# Altium schematic sheet pca10184_debugger_mcu.SchDoc: =ProductName + ' - Debugger'
size A3; DocumentNumber: 3; SheetNumber: 3; SheetTotal: 9
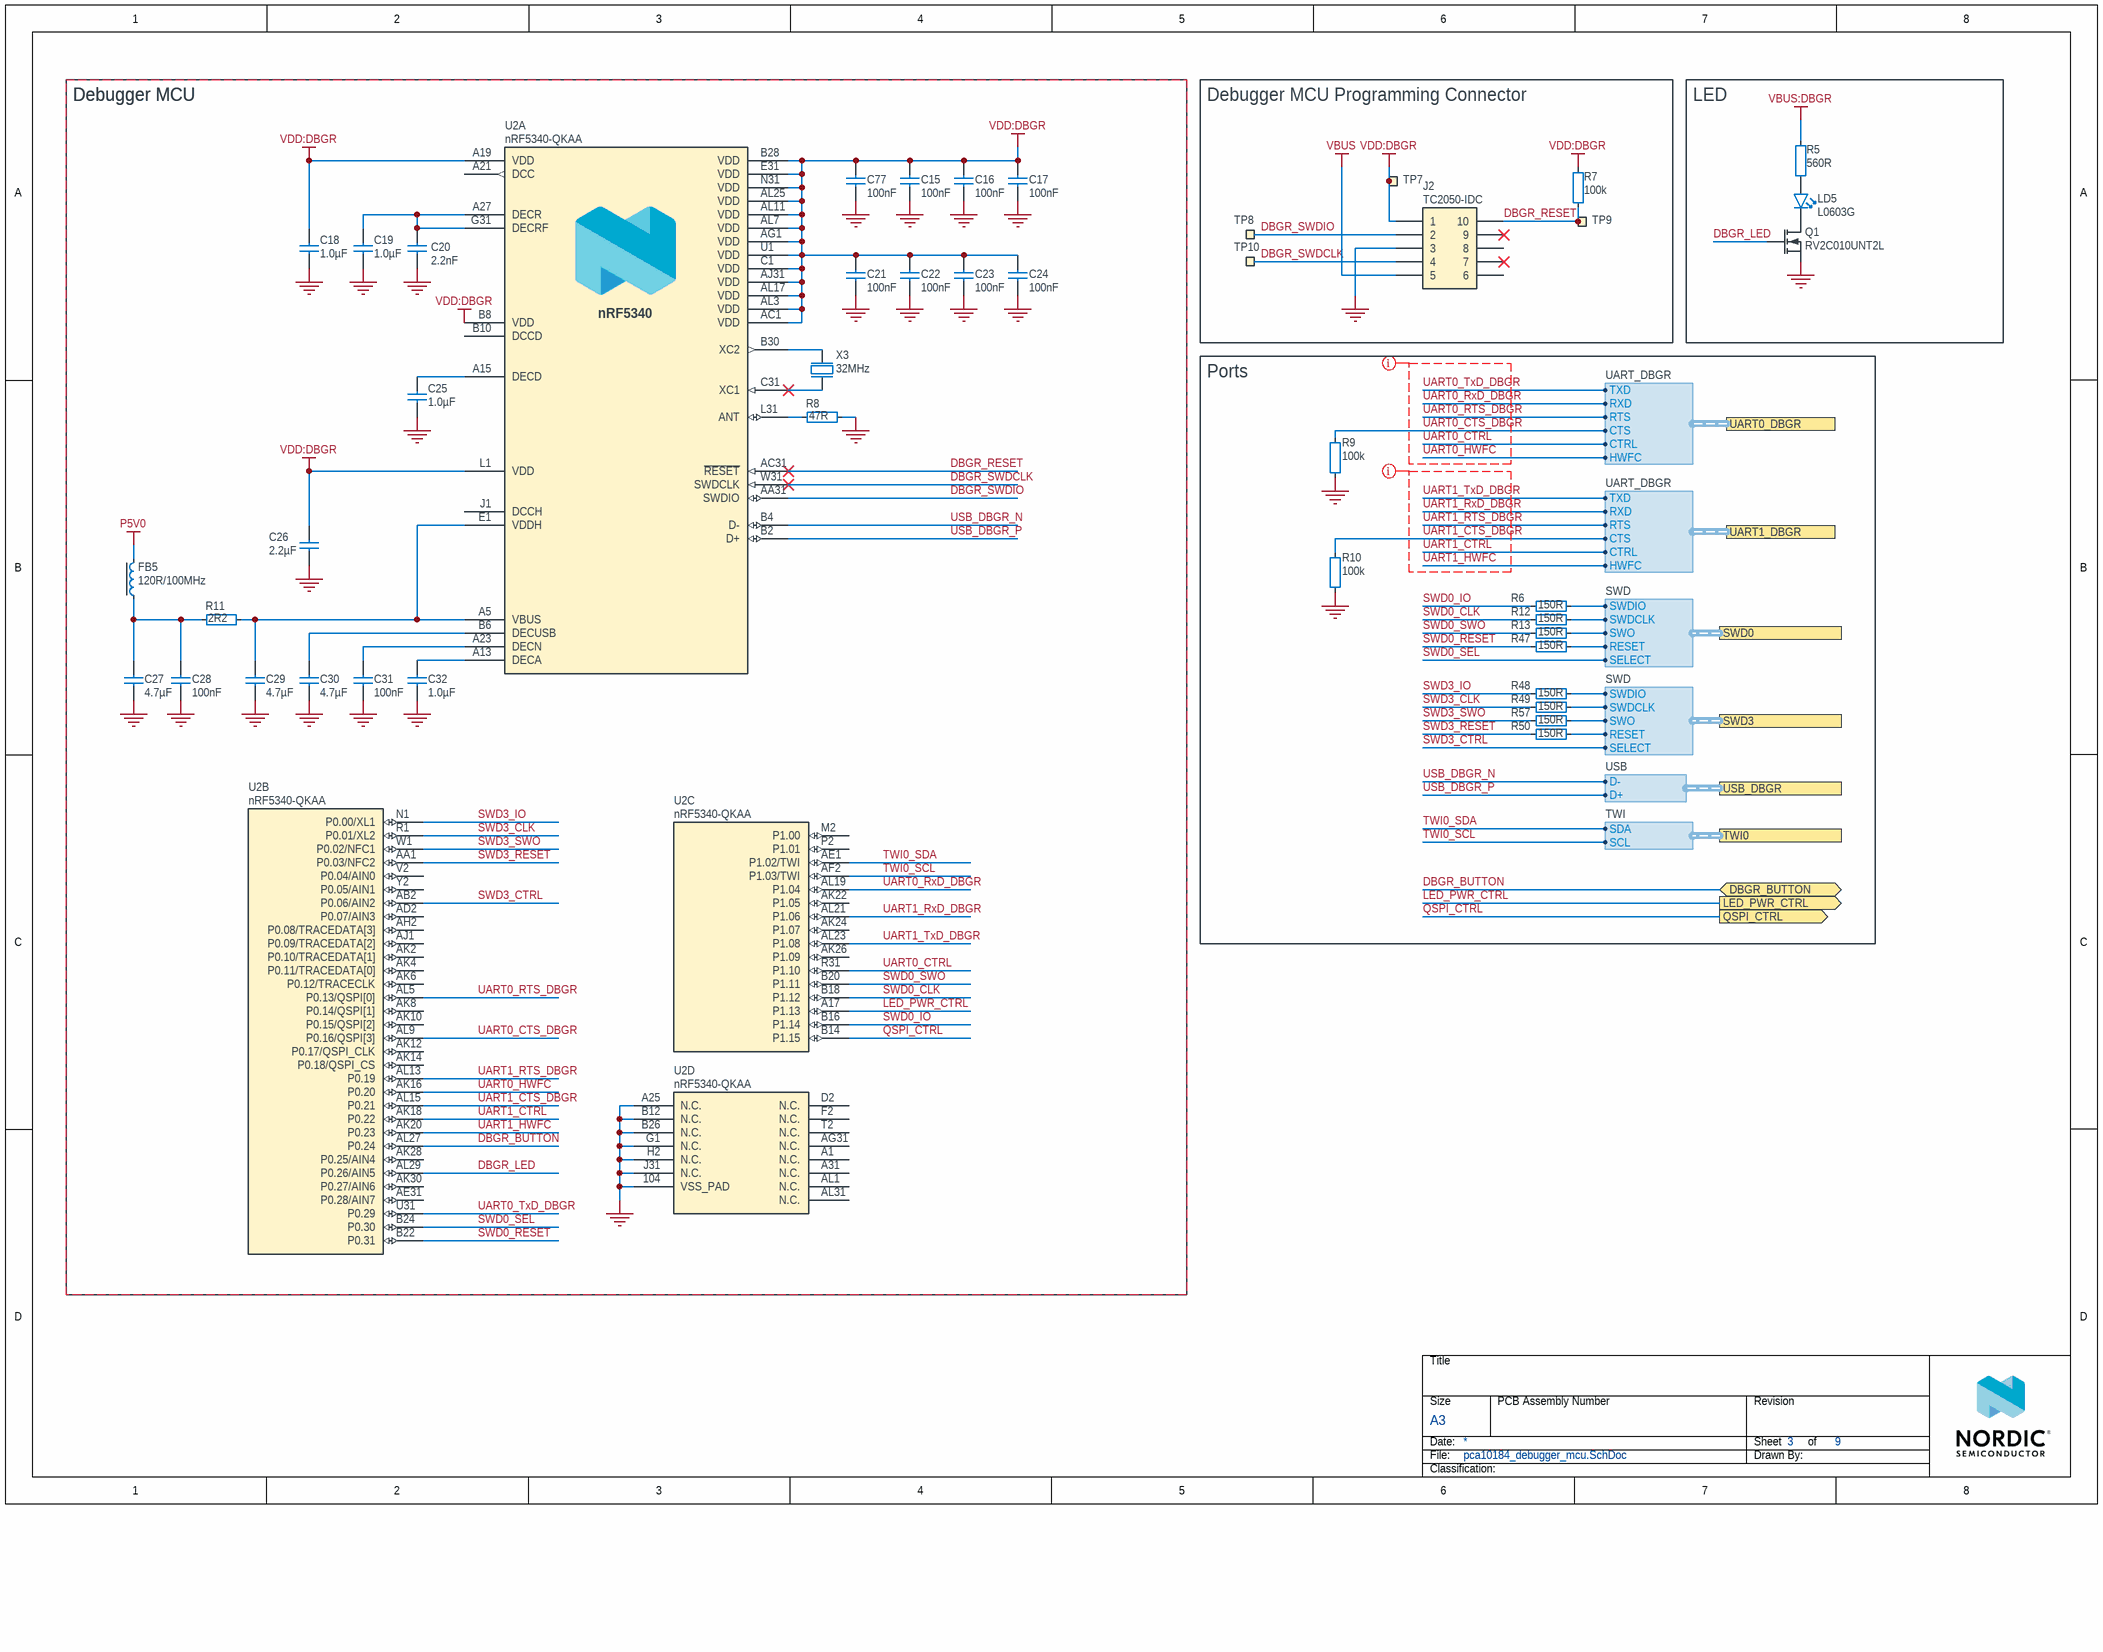
[diagram p0: pca10184_debugger_mcu.SchDoc]

## Parts
C15  100nF  [CAPC0603X03L_C]
C16  100nF  [CAPC0603X03L_C]
C17  100nF  [CAPC0603X03L_C]
C18  1.0µF  [CAPC1005X04L]
C19  1.0µF  [CAPC1005X04L]
C20  2.2nF  [CAPC0603X03L_C]
C21  100nF  [CAPC0603X03L_C]
C22  100nF  [CAPC0603X03L_C]
C23  100nF  [CAPC0603X03L_C]
C24  100nF  [CAPC0603X03L_C]
C25  1.0µF  [CAPC1005X04L]
C26  2.2µF  [CAPC1608X06L]
C27  4.7µF  [CAPC1608X06L]
C28  100nF  [CAPC0603X03L_C]
C29  4.7µF  [CAPC1608X06L]
C30  4.7µF  [CAPC1608X06L]
C31  100nF  [CAPC0603X03L_C]
C32  1.0µF  [CAPC1005X04L]
C77  100nF  [CAPC0603X03L_C]
FB5  120R/100MHz  [INDC1005X04L_C2]
J2  TC2050-IDC  [TC2050-IDC-NLFP]  (no BOM)
LD5  L0603G  [LED_0603_G]
Q1  RV2C010UNT2L  [DFN65P100X40-3L]
R5  560R  [RESC0603X03L_C]
R6  150R  [RESC0603X03L_C]
R7  100k  [RESC0603X03L_C]
R8  47R  [RESC0603X03L_C]
R9  100k  [RESC0603X03L_C]
R10  100k  [RESC0603X03L_C]
R11  2R2  [RESC1608X06L]
R12  150R  [RESC0603X03L_C]
R13  150R  [RESC0603X03L_C]
R47  150R  [RESC0603X03L_C]
R48  150R  [RESC0603X03L_C]
R49  150R  [RESC0603X03L_C]
R50  150R  [RESC0603X03L_C]
R57  150R  [RESC0603X03L_C]
TP7  Ø1.5mm,SMD  [TP_SMD_D1.5mm]  (value not drawn)  (no BOM)
TP8  Ø1.5mm,SMD  [TP_SMD_D1.5mm]  (value not drawn)  (no BOM)
TP9  Ø1.5mm,SMD  [TP_SMD_D1.5mm]  (value not drawn)  (no BOM)
TP10  Ø1.5mm,SMD  [TP_SMD_D1.5mm]  (value not drawn)  (no BOM)
U2  nRF5340-QKAA  [AQFN40P700X700X85_HS-99N]  (parts A,B,C,D of 4)
X3  32MHz  [BT-XTAL_2016]

## Blocks framed on the sheet
Debugger MCU Programming Connector: J2 R7 TP7-TP10
LED: LD5 Q1 R5
Ports: R6 R9 R10 R12 R13 R47-R50 R57

## Ports
DBGR_BUTTON (bidir), LED_PWR_CTRL (out), QSPI_CTRL (out), SWD0 (harness SWD), SWD3 (harness SWD), TWI0 (harness TWI), UART0_DBGR (harness UART_DBGR), UART1_DBGR (harness UART_DBGR), USB_DBGR (harness USB)

## Harnesses
UART_DBGR: RTS, CTS, RXD, TXD, HWFC, CTRL
SWD: SWDIO, SWDCLK, SWO, RESET, SELECT
USB: D+, D-
TWI: SCL, SDA

## Nets
GND: C15.2 C16.2 C17.2 C18.2 C19.1 C20.2 C21.2 C22.2 C23.2 C24.2 C25.1 C26.2 C27.2 C28.2 C29.2 C30.2 C31.2 C32.1 C77.2 J2.3 Q1.2(S) R8.2 R9.2 R10.2 U2.104(VSS_PAD) U2.A25(N.C.) U2.B12(N.C.) U2.B26(N.C.) U2.G1(N.C.) U2.H2(N.C.) U2.J31(N.C.) X3.2(GND) X3.4(GND)
P5V0: FB5.2
VBUS: J2.5
VBUS:DBGR: R5.2
VDD:DBGR: C15.1 C16.1 C17.1 C18.1 C21.1 C22.1 C23.1 C24.1 C26.1 C77.1 J2.1 R7.2 TP7.1 U2.A19(VDD) U2.AC1(VDD) U2.AG1(VDD) U2.AJ31(VDD) U2.AL3(VDD) U2.AL7(VDD) U2.AL11(VDD) U2.AL17(VDD) U2.AL25(VDD) U2.B8(VDD) U2.B28(VDD) U2.C1(VDD) U2.E31(VDD) U2.L1(VDD) U2.N31(VDD) U2.U1(VDD)
DBGR_BUTTON: U2.AL27(P0.24) ; port DBGR_BUTTON
DBGR_LED: Q1.1(G) U2.AL29(P0.26/AIN5)
DBGR_RESET: J2.10 R7.1 TP9.1 U2.AC31(~{RESET})
DBGR_SWDCLK: J2.4 TP10.1 U2.W31(SWDCLK)
DBGR_SWDIO: J2.2 TP8.1 U2.AA31(SWDIO)
LED_PWR_CTRL: U2.A17(P1.13) ; port LED_PWR_CTRL
QSPI_CTRL: U2.B14(P1.15) ; port QSPI_CTRL
SWD0_CLK: R12.1 U2.B18(P1.12)
SWD0_IO: R6.1 U2.B16(P1.14)
SWD0_RESET: R47.1 U2.B22(P0.31)
SWD0_SEL: U2.B24(P0.30) ; port SWD0.SELECT
SWD0_SWO: R13.1 U2.B20(P1.11)
SWD3_CLK: R49.1 U2.R1(P0.01/XL2)
SWD3_CTRL: U2.AB2(P0.06/AIN2) ; port SWD3.SELECT
SWD3_IO: R48.1 U2.N1(P0.00/XL1)
SWD3_RESET: R50.1 U2.AA1(P0.03/NFC2)
SWD3_SWO: R57.1 U2.W1(P0.02/NFC1)
TWI0_SCL: U2.AF2(P1.03/TWI) ; port TWI0.SCL
TWI0_SDA: U2.AE1(P1.02/TWI) ; port TWI0.SDA
UART0_CTRL: U2.R31(P1.10) ; port UART0_DBGR.CTRL
UART0_CTS_DBGR: R9.1 U2.AL9(P0.16/QSPI[3]) ; port UART0_DBGR.CTS
UART0_HWFC: U2.AK16(P0.20) ; port UART0_DBGR.HWFC
UART0_RTS_DBGR: U2.AL5(P0.13/QSPI[0]) ; port UART0_DBGR.RTS
UART0_RxD_DBGR: U2.AL19(P1.04) ; port UART0_DBGR.RXD
UART0_TxD_DBGR: U2.U31(P0.29) ; port UART0_DBGR.TXD
UART1_CTRL: U2.AK18(P0.22) ; port UART1_DBGR.CTRL
UART1_CTS_DBGR: R10.1 U2.AL15(P0.21) ; port UART1_DBGR.CTS
UART1_HWFC: U2.AK20(P0.23) ; port UART1_DBGR.HWFC
UART1_RTS_DBGR: U2.AL13(P0.19) ; port UART1_DBGR.RTS
UART1_RxD_DBGR: U2.AL21(P1.06) ; port UART1_DBGR.RXD
UART1_TxD_DBGR: U2.AL23(P1.08) ; port UART1_DBGR.TXD
USB_DBGR_N: U2.B4(D-) ; port USB_DBGR.D-
USB_DBGR_P: U2.B2(D+) ; port USB_DBGR.D+
NetC19_2: C19.2 C20.1 U2.A27(DECR) U2.G31(DECRF)
NetC25_2: C25.2 U2.A15(DECD)
NetC27_1: C27.1 C28.1 FB5.1 R11.1
NetC29_1: C29.1 R11.2 U2.A5(VBUS) U2.E1(VDDH)
NetC30_1: C30.1 U2.B6(DECUSB)
NetC31_1: C31.1 U2.A23(DECN)
NetC32_2: C32.2 U2.A13(DECA)
NetLD5_1: LD5.1(C) Q1.3(D)
NetLD5_2: LD5.2(A) R5.1
NetR6_2: R6.2 ; port SWD0.SWDIO
NetR8_1: R8.1 U2.L31(ANT)
NetR12_2: R12.2 ; port SWD0.SWDCLK
NetR13_2: R13.2 ; port SWD0.SWO
NetR47_2: R47.2 ; port SWD0.RESET
NetR48_2: R48.2 ; port SWD3.SWDIO
NetR49_2: R49.2 ; port SWD3.SWDCLK
NetR50_2: R50.2 ; port SWD3.RESET
NetR57_2: R57.2 ; port SWD3.SWO
NetU2_B30: U2.B30(XC2) X3.3(out)
NetU2_C31: U2.C31(XC1) X3.1(inp)

Not connected (* = marked no-connect by the designer): J2 6 7* 8 9*; U2 A1(N.C.) A21(DCC) A31(N.C.) AD2(P0.07/AIN3) AE31(P0.28/AIN7) AG31(N.C.) AH2(P0.08/TRACEDATA[3]) AJ1(P0.09/TRACEDATA[2]) AK2(P0.10/TRACEDATA[1]) AK4(P0.11/TRACEDATA[0]) AK6(P0.12/TRACECLK) AK8(P0.14/QSPI[1]) AK10(P0.15/QSPI[2]) AK12(P0.17/QSPI_CLK) AK14(P0.18/QSPI_CS) AK22(P1.05) AK24(P1.07) AK26(P1.09) AK28(P0.25/AIN4) AK30(P0.27/AIN6) AL1(N.C.) AL31(N.C.) B10(DCCD) D2(N.C.) F2(N.C.) J1(DCCH) M2(P1.00) P2(P1.01) T2(N.C.) V2(P0.04/AIN0) Y2(P0.05/AIN1)

## Layout directives
net class UART0: UART0_CTRL, UART0_CTS_DBGR, UART0_HWFC, UART0_RTS_DBGR, UART0_RxD_DBGR, UART0_TxD_DBGR
net class UART1: UART1_CTRL, UART1_CTS_DBGR, UART1_HWFC, UART1_RTS_DBGR, UART1_RxD_DBGR, UART1_TxD_DBGR

## Notes on the sheet
- Debugger MCU
- Title
- Size
- Date:
- File:
- A3
- PCB Assembly Number
- Sheet
- Drawn By:
- Revision
- of
- Classification:
- (in symbol nRF5340-QKAAD0, part A) nRF5340

## Library data of the parts
C15-C17 C21-C24 C28 C31 C77 = C0201-100n: Capacitor, X5R, ±10%, 100nF, 16V; Manufacturer: N.A.; Part number IPS: 00000001248, 00000002505; Part number Norautron: 262071862; Part number NEMS: 100200078; Pad Count: 2; Component Status: Active; Part Number: C0201-100n; Value: 100nF; Footprint Doc: 0201; Component Class: Capacitors; Author: rsk; PartId: 100200078; Manufacturer Part Number: N.A.; ComponentLink1URL: N.A.; ComponentLink1Description: Datasheet; ComponentLink2URL: N.A.; ComponentLink2Description: Supplier link; HelpURL: N.A.; LatestRevisionDate: 2024-06-27; Published: 2014-11-13; Note: 16V; Supplier 1: N.A.; Supplier Part Number 1: N.A.; Supplier 2: N.A.; Supplier Part Number 2: N.A.; Artikkelnr Noca: N.A.
C18 C19 C25 C32 = C0402-1µ0-6.3V-X5R-10%: Capacitor, X5R, ±10%, 6.3V; Manufacturer: N.A.; Part number Norautron: 26207137; Part number NEMS: 100200498; Pad Count: 2; Component Status: Active; Part Number: C0402-1µ0-6.3V-X5R-10%; Manufacturer Part Number: N.A.; LatestRevisionDate: 2022-01-27; Published: 2022-01-27; Value: 1.0µF; Note: 6.3V; Artikkelnr Noca: N.A.; Footprint Doc: 0402; ComponentLink1URL: N.A.; ComponentLink1Description: Datasheet; ComponentLink2URL: N.A.; ComponentLink2Description: Supplier link; HelpURL: N.A.; Supplier 1: N.A.; Supplier Part Number 1: N.A.; Supplier 2: N.A.; Supplier Part Number 2: N.A.; Part number IPS: N.A.; Component Class: Capacitors; PartId: 100200498; Author: rubr
C20 = C0201-2n2: Capacitor, X7R, ±10%, 10V; Manufacturer: N.A.; Part number IPS: 00000001778; Part number Norautron: 26470002; Part number NEMS: 100200060; Pad Count: 2; Component Status: Active; Part Number: C0201-2n2; LatestRevisionDate: 2014-11-13; Published: 2014-11-13; Value: 2.2nF; Footprint Doc: 0201; Manufacturer Part Number: N.A.; ComponentLink1URL: N.A.; ComponentLink1Description: Datasheet; ComponentLink2URL: N.A.; ComponentLink2Description: Supplier link; HelpURL: N.A.; Note: 10V; Supplier 1: N.A.; Supplier Part Number 1: N.A.; Supplier 2: N.A.; Supplier Part Number 2: N.A.; Artikkelnr Noca: N.A.; Component Class: Capacitors; PartId: 100200060; Author: rsk
C26 = C0603-2µ2-6.3V-X7R: Capacitor, X7R, ±10%, 2.2µF, 6.3V; Manufacturer: N.A.; Part number NEMS: 100200272; Artikkelnr Noca: 20039322; Pad Count: 2; Component Status: Active; Part Number: C0603-2µ2-6.3V-X7R; Manufacturer Part Number: N.A.; LatestRevisionDate: 2024-06-27; Published: 2009-05-08; Value: 2.2µF; Note: 6.3V; Footprint Doc: 0603; ComponentLink1URL: N.A.; ComponentLink1Description: Datasheet; ComponentLink2URL: N.A.; ComponentLink2Description: Supplier link; HelpURL: N.A.; Supplier 1: N.A.; Supplier Part Number 1: N.A.; Supplier 2: N.A.; Supplier Part Number 2: N.A.; Part number IPS: N.A.; Component Class: Capacitors; PartId: 100200272; Author: rsk; Part number Norautron: N.A.
C27 C29 = C0603-4µ7-10V-X7S: Capacitor, X7S, ±10%, 10V; Manufacturer: N.A.; Part number IPS: 00000001779; Part number NEMS: 100200351; Pad Count: 2; Artikkelnr Noca: 20030013; Component Status: Active; Part Number: C0603-4µ7-10V-X7S; Value: 4.7µF; Footprint Doc: 0603; Component Class: Capacitors; Author: rsk; PartId: 100200351; Manufacturer Part Number: N.A.; ComponentLink1URL: N.A.; ComponentLink1Description: Datasheet; ComponentLink2URL: N.A.; ComponentLink2Description: Supplier link; HelpURL: N.A.; LatestRevisionDate: 2016-08-15; Published: 2016-08-15; Note: 10V; Supplier 1: Digi-Key; Supplier Part Number 1: 445-14258-1-ND; Supplier 2: N.A.; Supplier Part Number 2: N.A.; Part number Norautron: N.A.
C30 = C0603-4µ7-6.3V-X7R: Capacitor, X7R, ±10%, 6.3V; Manufacturer: Samsung Electro-Mechanics America; Manufacturer Part Number: CL10B475KQ8NQNC; Part number IPS: 00000002541; Part number Norautron: N.A.; Part number NEMS: 100200350; Pad Count: 2; Artikkelnr Noca: 20039473; Component Status: Active; Part Number: C0603-4µ7-6.3V-X7R; Value: 4.7µF; Footprint Doc: 0603; Component Class: Capacitors; Author: rsk; PartId: 100200350; ComponentLink1URL: N.A.; ComponentLink1Description: Datasheet; ComponentLink2URL: N.A.; ComponentLink2Description: Supplier link; HelpURL: http://media.digikey.com/pdf/Data%20Sheets/Samsung%20PDFs/CL10B475KQ8NQNC_Spec.pdf; LatestRevisionDate: 2015-06-10; Published: 2015-06-10; Note: 6.3V; Supplier 1: Digi-Key; Supplier Part Number 1: 1276-2087-1-ND; Supplier 2: N.A.; Supplier Part Number 2: N.A.
FB5 = FB0402-120R@100MHz-1200mA-BLM15EX121SN1_C2: Ferrite Bead, 120 Ohm @ 100MHz, 1200mA, 75 mOhm Max; Manufacturer: Murata; Part number NEMS: 100300431, 100300416; Component Status: Active; Pad Count: 2; Note: N.A.; Part Number: FB0402-120R@100MHz-1200mA-BLM15EX121SN1_C2; PartId: 100300431; Component Class: Inductors; Author: rubr; Manufacturer Part Number: BLM15EX121SN1; ComponentLink1URL: https://www.murata.com/en-us/products/productdata/8796750970910/ENFA0023.pdf; ComponentLink1Description: Datasheet; ComponentLink2URL: N.A.; ComponentLink2Description: Supplier link; HelpURL: https://www.murata.com/en-us/products/productdetail?partno=BLM15EX121SN1%23; LatestRevisionDate: 2023-03-22; Published: 2023-03-22; Footprint Doc: 0402; Value: 120R/100MHz; Supplier 1: Digi-Key; Supplier Part Number 1: 490-16509-1-ND; Supplier 2: Mouser; Supplier Part Number 2: 81-BLM15EX121SN1D; Artikkelnr Noca: N.A.; Part number IPS: N.A.; Part number Norautron: N.A.
J2 = TC2050-IDC-NLFP: CBL PLUG-OF-NAILS 10-PIN; Manufacturer: Tag-Connect LLC; Part number NEMS: 100500463; Artikkelnr Noca: N.A.; Pad Count: 10; Component Status: Active; System: Connector; Part Number: TC2050-IDC-NLFP; Manufacturer Part Number: TC2050-IDC-NLFP; LatestRevisionDate: 2012-11-21; Published: 2012-11-21; Value: TC2050-IDC; Footprint Doc: TC2050-IDC-NLFP; Part number IPS: N.A.; ComponentLink1URL: N.A.; ComponentLink1Description: Datasheet; ComponentLink2URL: N.A.; ComponentLink2Description: Supplier link; HelpURL: http://www.tag-connect.com/Materials/TC2050-IDC%20Datasheet.pdf; Supplier 1: Digi-Key; Supplier Part Number 1: TC2050-IDC-NL-ND; Supplier 2: N.A.; Supplier Part Number 2: N.A.; Component Class: Connectors; Note: N.A.; PartId: 100500463; Author: rsk; Part number Norautron: N.A.
LD5 = VS 25C7M5: LED, Green, 0603, 573nm, Vf=2.0V, 24mcd, - 40 to +85°C; Manufacturer: Victory Electronics; Part number IPS: 00000001274, 00000009961; Part number Norautron: 26313411; Part number NEMS: 101400097; Pad Count: 2; Note: N.A.; Artikkelnr Noca: 13019193; Component Status: Active; Part Number: VS 25C7M5; PartId: 101400097; Component Class: Optoelectronics; Author: rsk; Manufacturer Part Number: VS 25C7M5; ComponentLink1URL: N.A.; ComponentLink1Description: Datasheet; ComponentLink2URL: N.A.; ComponentLink2Description: Supplier link; HelpURL: \\hizz\pro\app9717\Datasheet\optoelectronics\Victory Electronics\VS 25C7M5.pdf; Footprint Doc: 0603; LatestRevisionDate: 2020-10-23; Published: 2017-08-21; Value: L0603G; Supplier 1: EC Partner; Supplier Part Number 1: N.A.; Supplier 2: N.A.; Supplier Part Number 2: N.A.
Q1 = RV2C010UNT2L: N-Channel MOSFET, 20V, 1A, 470mOhm, 400mW, -55°C ~ 150°C; Manufacturer: Rohm Semiconductor; Part number IPS: 00000009976; Part number Norautron: 26320026; Part number NEMS: 101300132; Note: N.A.; Artikkelnr Noca: 35010020; Pad Count: 3; Component Status: Active; Part Number: RV2C010UNT2L; Manufacturer Part Number: RV2C010UNT2L; ComponentLink1URL: N.A.; ComponentLink1Description: Datasheet; ComponentLink2URL: N.A.; ComponentLink2Description: Supplier link; HelpURL: http://rohmfs.rohm.com/en/products/databook/datasheet/discrete/transistor/mosfet/rv2c010unt2l-e.pdf; Footprint Doc: DFN-3; LatestRevisionDate: 2024-09-18; Published: 2016-08-09; Value: RV2C010UNT2L; Supplier 1: Digi-Key; Supplier Part Number 1: RV2C010UNT2LCT-ND; Supplier 2: Mouser; Supplier Part Number 2: 755-RV2C010UNT2L; PartId: 101300132; Component Class: Semiconductors; Author: rsk
R5 = R0201-560: Resistor, ±1%, 0.05W; Manufacturer: N.A.; Part number NEMS: 100100038; Note: Chip Res 1%; Pad Count: 2; Component Status: Active; Part Number: R0201-560; Manufacturer Part Number: N.A.; ComponentLink1URL: N.A.; ComponentLink1Description: Datasheet; ComponentLink2URL: N.A.; ComponentLink2Description: Supplier link; HelpURL: N.A.; Footprint Doc: 0201; LatestRevisionDate: 2014-11-13; Published: 2014-11-13; Value: 560R; Supplier 1: N.A.; Supplier Part Number 1: N.A.; Supplier 2: N.A.; Supplier Part Number 2: N.A.; Artikkelnr Noca: N.A.; Part number IPS: N.A.; PartId: 100100038; Component Class: Resistors; Author: rsk; Part number Norautron: N.A.
R6 R12 R13 R47-R50 R57 = R0201-150: Resistor, ±1%, 0.05W; Manufacturer: N.A.; Part number IPS: 00000001420; Part number NEMS: 100100029; Note: Chip Res 1%; Pad Count: 2; Component Status: Active; Part Number: R0201-150; Manufacturer Part Number: N.A.; ComponentLink1URL: N.A.; ComponentLink1Description: Datasheet; ComponentLink2URL: N.A.; ComponentLink2Description: Supplier link; HelpURL: N.A.; Footprint Doc: 0201; LatestRevisionDate: 2014-11-13; Published: 2014-11-13; Value: 150R; Artikkelnr Noca: N.A.; Supplier 1: N.A.; Supplier Part Number 1: N.A.; Supplier 2: N.A.; Supplier Part Number 2: N.A.; PartId: 100100029; Component Class: Resistors; Author: rsk; Part number Norautron: N.A.
R7 R9 R10 = R0201-100k: Resistor, ±1%, 0.05W; Manufacturer: N.A.; Part number IPS: 00000001419; Part number Norautron: 26108487; Part number NEMS: 100100080; Note: Chip Res 1%; Pad Count: 2; Component Status: Active; Part Number: R0201-100k; Manufacturer Part Number: N.A.; ComponentLink1URL: N.A.; ComponentLink1Description: Datasheet; ComponentLink2URL: N.A.; ComponentLink2Description: Supplier link; HelpURL: N.A.; Footprint Doc: 0201; LatestRevisionDate: 2014-11-13; Published: 2014-11-13; Value: 100k; Artikkelnr Noca: N.A.; Supplier 1: N.A.; Supplier Part Number 1: N.A.; Supplier 2: N.A.; Supplier Part Number 2: N.A.; Component Class: Resistors; PartId: 100100080; Author: rsk
R8 = R0201-47R: Resistor, ±1%, 0.05W; Manufacturer: N.A.; Part number IPS: 00000004794; Part number Norautron: 26108300; Part number NEMS: 100100022; Component Status: Active; Pad Count: 2; Note: Chip Res 1%; Part Number: R0201-47R; PartId: 100100022; Component Class: Resistors; Author: rsk; Manufacturer Part Number: N.A.; ComponentLink1URL: N.A.; ComponentLink1Description: Datasheet; ComponentLink2URL: N.A.; ComponentLink2Description: Supplier link; HelpURL: N.A.; LatestRevisionDate: 2014-11-13; Published: 2014-11-13; Footprint Doc: 0201; Value: 47R; Supplier 1: N.A.; Supplier Part Number 1: N.A.; Supplier 2: N.A.; Supplier Part Number 2: N.A.; Artikkelnr Noca: N.A.
R11 = R0603-2R2: RES 2.2 OHM 1% 1/10W 0603; Manufacturer: N.A.; Part number NEMS: 100100736; Pad Count: 2; Note: Chip Res 1%; Component Status: Active; Part Number: R0603-2R2; Footprint Doc: 0603; Value: 2R2; Component Class: Resistors; Author: getr; PartId: 100100736; Manufacturer Part Number: N.A.; ComponentLink1URL: N.A.; ComponentLink1Description: Datasheet; ComponentLink2URL: N.A.; ComponentLink2Description: Supplier link; HelpURL: N.A.; LatestRevisionDate: 2025-05-14; Published: 2025-05-14; Supplier 1: N.A.; Supplier Part Number 1: N.A.; Supplier 2: N.A.; Supplier Part Number 2: N.A.; Artikkelnr Noca: N.A.; Part number IPS: N.A.; Part number Norautron: N.A.
TP7-TP10 = TP_SMD_Ø1.5MM: 1.5mm circular SMD testpad; Manufacturer: Nordic Semiconductor; Manufacturer Part Number: N.A.; Part number NEMS: 100500477; Pad Count: 1; Component Status: Active; Part Number: TP_SMD_Ø1.5MM; ComponentLink1URL: N.A.; ComponentLink1Description: Datasheet; ComponentLink2URL: N.A.; ComponentLink2Description: Supplier link; HelpURL: N.A.; Footprint Doc: TP_SMD_Ø1.5mm; LatestRevisionDate: 2021-03-05; Published: 2016-06-02; Value: Ø1.5mm,SMD; Note: N.A.; Artikkelnr Noca: N.A.; Part number IPS: N.A.; Supplier 1: N.A.; Supplier Part Number 1: N.A.; Supplier 2: N.A.; Supplier Part Number 2: N.A.; Component Class: Connectors; PartId: 100500477; Author: rsk; Part number Norautron: N.A.
U2 = nRF5340-QKAAD0: Multi-protocol Bluetooth Low Energy, IEEE 802.15.4, ANT and 2.4GHz proprietary system-on-chip; Manufacturer: Nordic Semiconductor; Part number Norautron: NOD26470035; Part number NEMS: 102000216; Pad Count: 98; Note: N.A.; Component Status: Active; Part Number: nRF5340-QKAAD0; Footprint Doc: AQFN-98; Value: nRF5340-QKAA; Component Class: Nordic_Devices; Author: rsk; PartId: 102000216; Manufacturer Part Number: nRF5340-QKAAD0; ComponentLink1URL: N.A.; ComponentLink1Description: Datasheet; ComponentLink2URL: N.A.; ComponentLink2Description: Supplier link; HelpURL: N.A.; LatestRevisionDate: 2020-12-02; Published: 2020-12-02; Supplier 1: Nordic Semiconductor; Supplier Part Number 1: nRF5340-QKAAD0; Supplier 2: N.A.; Supplier Part Number 2: N.A.; Artikkelnr Noca: N.A.; Part number IPS: N.A.
X3 = XTAL_SMD2016_32MHz_8pF_Golledge: XTAL SMD 2016, 32MHz, Cl=8pF, Tol: ±10ppm, Stab: ±15ppm; Manufacturer Part Number: MP06003; Part number IPS: 00000001431; Part number Norautron: N.A.; Part number NEMS: 101600041; Note: XTAL SMD 32.000MHz; Artikkelnr Noca: 22010050; Pad Count: 4; Component Status: Active; Part Number: XTAL_SMD2016_32MHz_8pF_Golledge; Manufacturer: Golledge; LatestRevisionDate: 2016-11-02; Published: 2016-11-02; Value: 32MHz; Footprint Doc: XTAL_2016; ComponentLink1URL: N.A.; ComponentLink1Description: Datasheet; ComponentLink2URL: N.A.; ComponentLink2Description: Supplier link; HelpURL: \\hizz\pro\app9717\Datasheet\crystals\Golledge\mp06003.pdf; Supplier 1: Link Nordic; Supplier Part Number 1: N.A.; Supplier 2: N.A.; Supplier Part Number 2: N.A.; PartId: 101600041; Component Class: Oscillators; Author: rsk